# Altium schematic sheet Res 4.7K.schdoc
size 127 x 99 mm
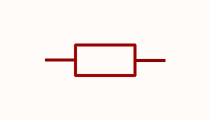
[diagram p0: Res 4.7K.schdoc]

## Parts
R?  4.7kΩ  [R0603]  (value not drawn)

## Nets

Not connected (* = marked no-connect by the designer): R? 1 2

## Library data of the parts
R? = ERJPA3F4701V: Manufacturer: PANASONIC(松下); Add into BOM: yes; Tolerance: ±1%; Power(Watts): 333mW; Temperature Coefficient: ±100ppm/℃; Symbol: ERJPA3F4701V; Device: ERJPA3F4701V; LCSC Part Name: 4.7kΩ ±1% 333mW 厚膜电阻; Supplier Part: C441924; Manufacturer Part: ERJPA3F4701V; Supplier Footprint: 0603; JLCPCB Part Class: Extended Part; Supplier: LCSC; Convert to PCB: yes; Type: Thick Film Resistors; Value: 4.7kΩ; Overload Voltage (Max): -; Operating Temperature Range: -55℃~+155℃